# Altium schematic sheet Juricic_Ivan.SchDoc
size A
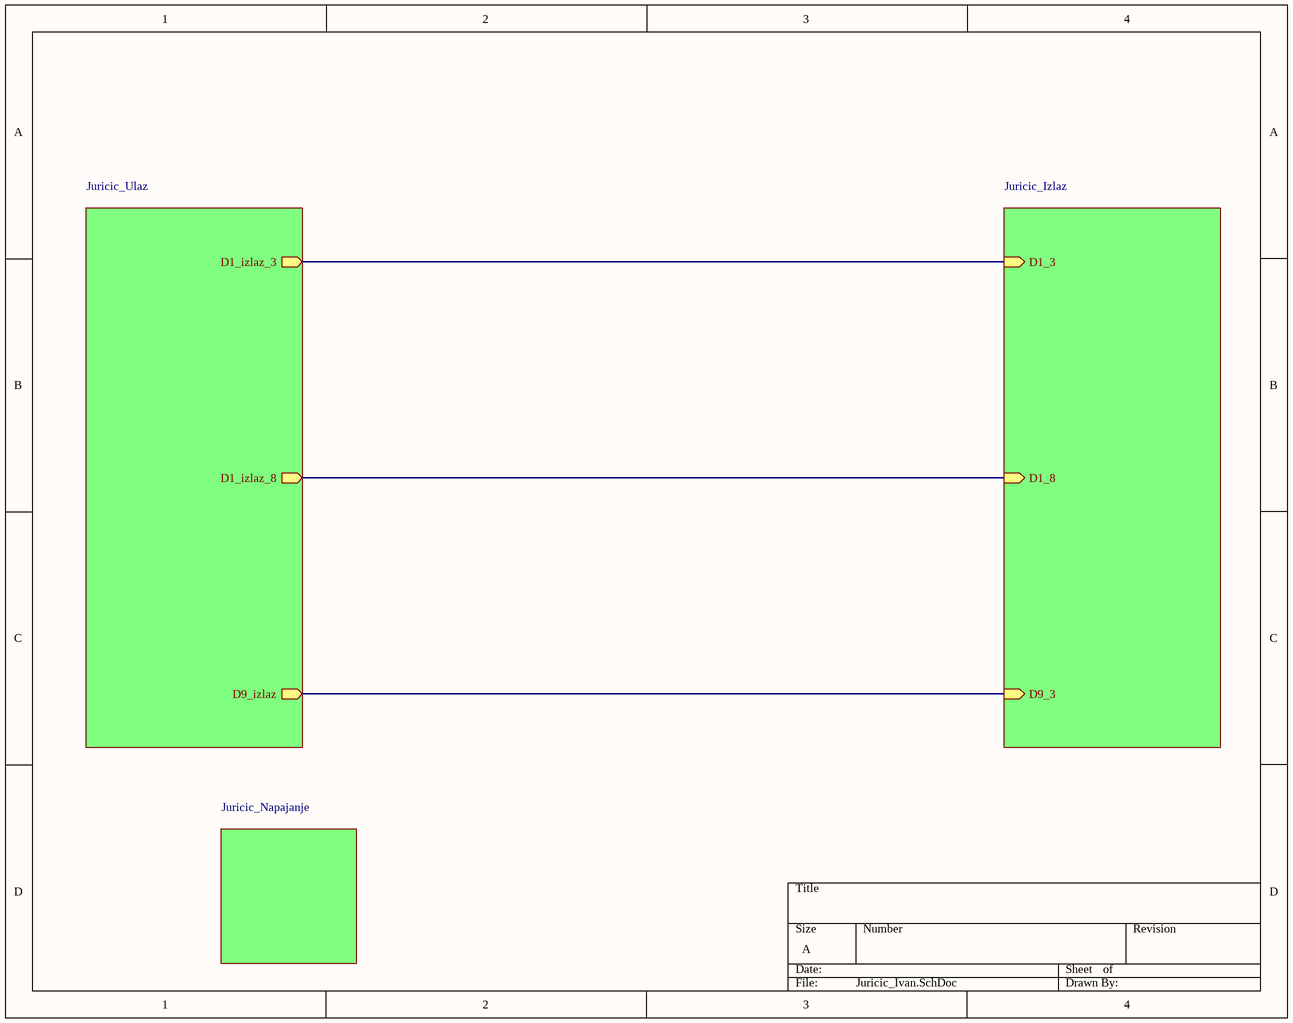
[diagram p0: Juricic_Ivan.SchDoc]

## Sub-sheets
Juricic_Izlaz = Juricic_Izlaz: D1_3 (in), D1_8 (in), D9_3 (in)
Juricic_Napajanje = Juricic_Napajanje: no entries
Juricic_Ulaz = Juricic_Ulaz: D9_izlaz (out), D1_izlaz_8 (out), D1_izlaz_3 (out)

## Nets
(unnamed): sheet Juricic_Ulaz/D9_izlaz, sheet Juricic_Izlaz/D9_3
(unnamed): sheet Juricic_Ulaz/D1_izlaz_8, sheet Juricic_Izlaz/D1_8
(unnamed): sheet Juricic_Ulaz/D1_izlaz_3, sheet Juricic_Izlaz/D1_3